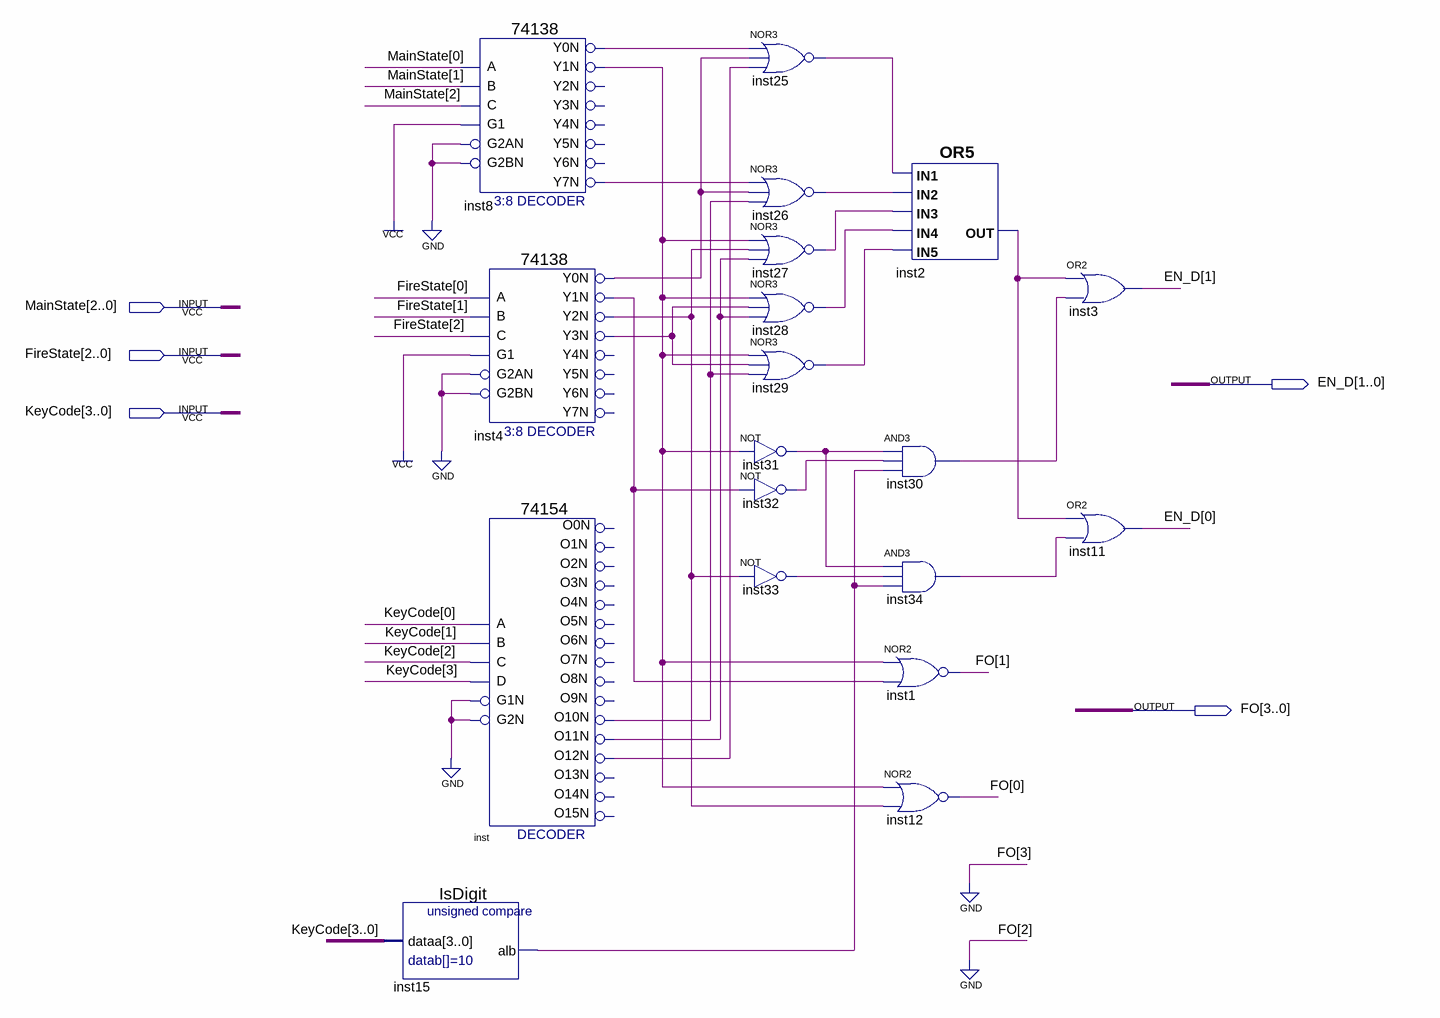
[diagram p0: schematic sheet]
// Quartus schematic FireDENControl.bdf as structural Verilog: 19 symbols, 5 pins
module FireDENControl (
  input  [2:0] MainState,
  input  [2:0] FireState,
  input  [3:0] KeyCode,
  output [1:0] EN_D,
  output [3:0] FO
);

  wire inst2_out, inst4_y0n, inst4_y1n, inst4_y2n, inst4_y3n, inst8_y0n, inst8_y1n, inst8_y7n, inst15_alb,
       inst25_out, inst26_out, inst27_out, inst28_out, inst29_out, inst30_out, inst31_out, inst32_out,
       inst33_out, inst34_out, inst_o10n, inst_o11n, inst_o12n;

  IsDigit inst15 (.dataa(KeyCode), .alb(inst15_alb));
  \74138  inst8 (
    .A(MainState[0]), .B(MainState[1]), .G1(1'b1), .C(MainState[2]), .G2AN(1'b0), .G2BN(1'b0),
    .Y0N(inst8_y0n), .Y1N(inst8_y1n), .Y7N(inst8_y7n));  // open: Y2N, Y3N, Y4N, Y5N, Y6N
  \74138  inst4 (
    .A(FireState[0]), .B(FireState[1]), .G1(1'b1), .C(FireState[2]), .G2AN(1'b0), .G2BN(1'b0),
    .Y0N(inst4_y0n), .Y1N(inst4_y1n), .Y2N(inst4_y2n), .Y3N(inst4_y3n));  // open: Y4N, Y5N, Y6N, Y7N
  \74154  inst (
    .C(KeyCode[2]), .D(KeyCode[3]), .B(KeyCode[1]), .A(KeyCode[0]), .G1N(1'b0), .G2N(1'b0), .O12N(inst_o12n),
    .O10N(inst_o10n), .O11N(inst_o11n));  // open: O0N, O15N, O1N, O13N, O14N, O4N, O3N, O2N, O7N, O6N, O5N, O9N, O8N
  nor inst25 (inst25_out, inst8_y0n, inst4_y0n, inst_o12n);
  nor inst26 (inst26_out, inst8_y7n, inst4_y0n, inst_o10n);
  nor inst27 (inst27_out, inst8_y1n, inst4_y2n, inst_o11n);
  nor inst28 (inst28_out, inst8_y1n, inst4_y3n, inst_o11n);
  nor inst29 (inst29_out, inst8_y1n, inst4_y3n, inst_o10n);
  not inst31 (inst31_out, inst8_y1n);
  not inst32 (inst32_out, inst4_y1n);
  not inst33 (inst33_out, inst4_y2n);
  and inst30 (inst30_out, inst31_out, inst32_out, inst15_alb);
  and inst34 (inst34_out, inst31_out, inst33_out, inst15_alb);
  nor inst1 (FO[1], inst8_y1n, inst4_y1n);
  nor inst12 (FO[0], inst8_y1n, inst4_y2n);
  or inst2 (inst2_out, inst25_out, inst26_out, inst27_out, inst28_out, inst29_out);
  or inst3 (EN_D[1], inst2_out, inst30_out);
  or inst11 (EN_D[0], inst2_out, inst34_out);

  assign FO[3:2] = 2'b00;
endmodule
